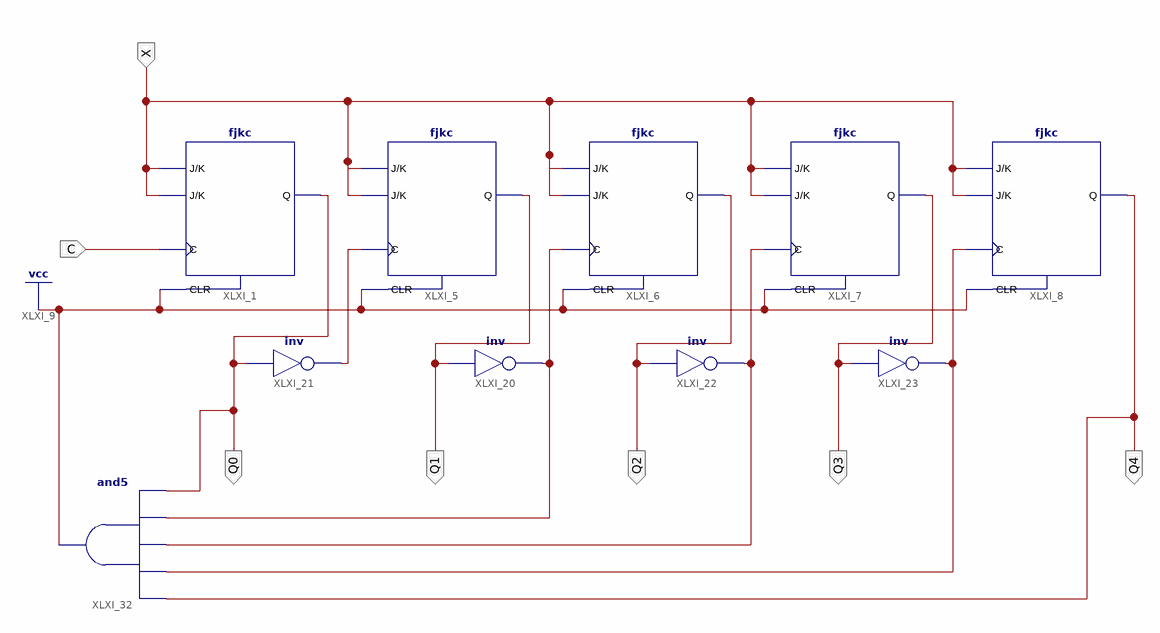
[diagram p0: schematic sheet 1]
// Xilinx ISE schematic Schem.sch (virtex5) as structural Verilog: 10 symbols, 7 ports
module Schem (
  input  X,
  input  C,
  output Q1,
  output Q2,
  output Q3,
  output Q4,
  output Q0
);

  wire XLXN_43, XLXN_47, XLXN_49, XLXN_96;

  fjkc XLXI_5 (.C(XLXN_43), .CLR(1'b1), .J(X), .K(X), .Q(Q1));
  fjkc XLXI_6 (.C(XLXN_96), .CLR(1'b1), .J(X), .K(X), .Q(Q2));
  fjkc XLXI_7 (.C(XLXN_47), .CLR(1'b1), .J(X), .K(X), .Q(Q3));
  fjkc XLXI_8 (.C(XLXN_49), .CLR(1'b1), .J(X), .K(X), .Q(Q4));
  fjkc XLXI_1 (.C(C), .CLR(1'b1), .J(X), .K(X), .Q(Q0));
  not XLXI_20 (XLXN_96, Q1);
  not XLXI_21 (XLXN_43, Q0);
  not XLXI_22 (XLXN_47, Q2);
  not XLXI_23 (XLXN_49, Q3);
  // and5 XLXI_32 has open pins: I0=Q0, I1=XLXN_96, I2=XLXN_47, I3=XLXN_49, I4=Q4, O=1'b1
endmodule
